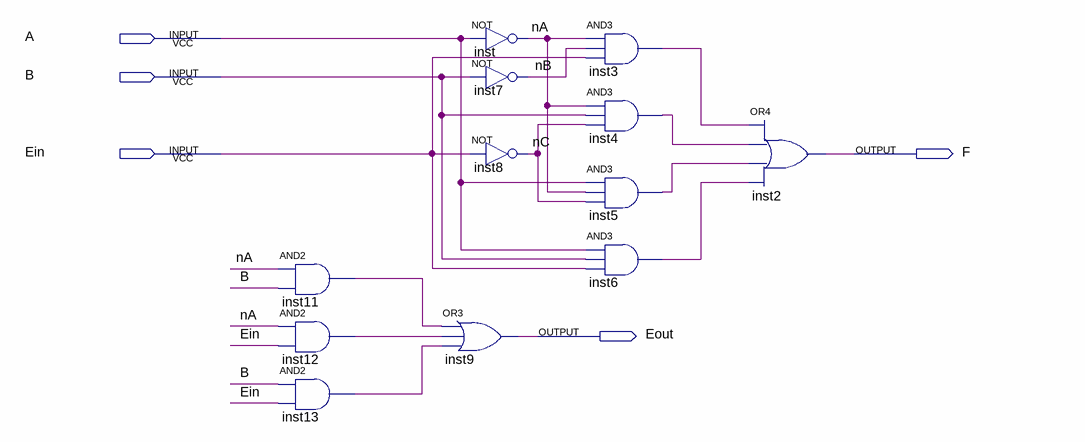
[diagram p0: schematic sheet]
// Quartus schematic SUB1.bdf as structural Verilog: 12 symbols, 5 pins
module SUB1 (
  input  A,
  input  B,
  input  Ein,
  output F,
  output Eout
);

  wire inst3_out, inst4_out, inst5_out, inst6_out, inst11_out, inst12_out, inst13_out, nA, nB, nC;

  and inst11 (inst11_out, nA, B);
  and inst12 (inst12_out, nA, Ein);
  and inst13 (inst13_out, B, Ein);
  or inst9 (Eout, inst11_out, inst12_out, inst13_out);
  not inst (nA, A);
  not inst7 (nB, B);
  not inst8 (nC, Ein);
  and inst3 (inst3_out, nA, nB, Ein);
  and inst4 (inst4_out, nA, B, nC);
  and inst5 (inst5_out, A, nA, nC);
  and inst6 (inst6_out, A, B, Ein);
  or inst2 (F, inst3_out, inst4_out, inst5_out, inst6_out);
endmodule
